# EasyEDA Pro project e_oct_dice_Dec_2022.eprj, board e_oct_dice_pcb_v0_3
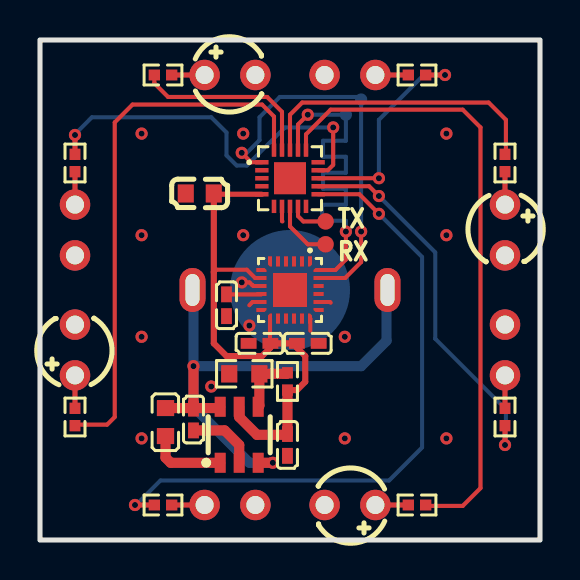
[diagram p9: board, top side]
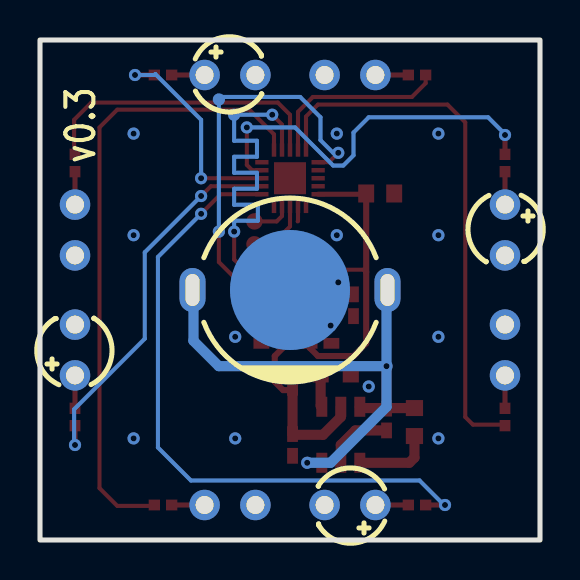
[diagram p10: board, bottom side, seen from below]

Outline 25 x 25 mm; copper layers: Top Layer, Bottom Layer. Coordinates in mm from the lower left corner of the outline.
Outline path: rectangle 0,25 25,0
Stack: Top Layer 0.035mm / Dielectric1 1.51mm FR4 er 4.5 / Bottom Layer 0.035mm

## Design rules (mm)
spacing safeClearance (default): track to track 0.152, other pairs 0.152 to 0.3
track width trackWidth (default): min 0.127, default 0.203, max 2.54
differential pair differentialPair (default): width min 0.127, default 0.254, max 2.54; gap min 0.152, default 0.152
via viaSize (default): diameter min 0.5, default 0.61, max 10; hole min 0.3, default 0.305, max 6

## Placement (name value [footprint] x y rotation side)
BT1  MY-927-01  [BAT-TH_MY-927-01]  12.5 12.5 180 bottom
C1  4.7uF  [C0402]  7.67 6.02 270 top
C2  4.7nF  [C0402]  12.37 4.75 90 top
C3  100nF  [C0402_NEW]  9.32 11.74 270 top
C4  10nF  [C0402]  13.39 9.83 0 top
C5  100nF  [C0402_NEW]  10.98 9.83 180 top
C6  22uF  [C0603]  7.99 17.33 0 top
L1  4.7uH  [L0603]  6.28 5.9 90 top
LED1  XL-302UWC  [LED-TH_BD3.8-P2.54-FD_WHITE]  15.5 1.75 180 top
LED2  XL-302UWC  [LED-TH_BD3.8-P2.54-FD_WHITE]  23.25 15.5 270 top
LED3  XL-302UWC  [LED-TH_BD3.8-P2.54-FD_WHITE]  9.5 23.25 0 top
LED4  XL-302UWC  [LED-TH_BD3.8-P2.54-FD_WHITE]  1.75 9.5 90 top
LED5  XL-302UWC  [LED-TH_BD3.8-P2.54-FD_WHITE]  9.5 1.75 0 bottom
LED6  XL-302UWC  [LED-TH_BD3.8-P2.54-FD_WHITE]  23.25 9.5 90 bottom
LED7  XL-302UWC  [LED-TH_BD3.8-P2.54-FD_WHITE]  15.5 23.25 180 bottom
LED8  XL-302UWC  [LED-TH_BD3.8-P2.54-FD_WHITE]  1.75 15.5 270 bottom
NOREF  -  [Pad_e1971]  14.28 14.79 0 top
NOREF#2  -  [Pad_e1246]  16.06 22.03 0 top
NOREF#3  -  [Pad_e1247]  15.29 21.26 0 top
NOREF#4  -  [Pad_e1972]  14.28 15.93 0 top
PR1  TPS61070DDCR  [SOT-23-6_L2.9-W1.6-P0.95-LS2.8-BR]  9.96 5.26 270 top
R1  1MΩ  [R0402]  12.37 7.93 270 top
R2  180kΩ  [R0603]  10.21 8.31 0 top
R3  470Ω  [R0402]  18.85 1.75 180 top
R4  470Ω  [R0402]  23.25 18.85 270 top
R5  470Ω  [R0402]  6.15 23.25 0 top
R6  470Ω  [R0402]  1.75 6.15 90 top
R7  470Ω  [R0402]  6.15 1.75 0 top
R8  470Ω  [R0402]  23.25 6.15 90 top
R9  470Ω  [R0402]  18.85 23.25 180 top
R10  470Ω  [R0402]  1.75 18.85 270 top
U1  STC8G1K17-38I-QFN20  [TQFN-20L_L3.0-W3.0-P0.40-BL-EP]  12.5 18.09 270 top
U2  MPU6500  [QFN-24_L3.0-W3.0-P0.40-BL-EP]  12.5 12.5 180 top

## Footprints (pads in the part's own frame, mm; a bottom-side part is the same pattern mirrored in y, then rotated)
BAT-TH_MY-927-01
  oval 1.3x2.2 hole 0.701x1.6: 1(-4.875,0) 1(4.875,0)
  round 6 smd: 2(0,0)
C0402
  rect 0.79x0.54 smd: 1(-0.545,0) 2(0.545,0)
C0402_NEW
  rect 0.79x0.54 smd: 1(-0.545,0) 2(0.545,0)
C0603
  rect 0.8x0.9 smd: 1(-0.7,0) 2(0.7,0)
L0603
  rect 0.8x0.864 smd: 1(-0.7,0) 2(0.7,0)
LED-TH_BD3.8-P2.54-FD_WHITE
  round 1.524 hole 0.9: 1(-1.27,0) 2(1.27,0)
Pad_e1246
  round 0.61 smd far side: TP4(0,0)
Pad_e1247
  round 0.61 smd far side: TP5(0,0)
Pad_e1971
  round 0.82 smd: TP1(0,0)
Pad_e1972
  round 0.82 smd: TP2(0,0)
QFN-24_L3.0-W3.0-P0.40-BL-EP
  custom 0.2x0.506 smd: 1(-1,-1.427) 6(1,-1.427) 13(1,1.427) 18(-1,1.427)
  rect 0.2x0.505 smd: 2(-0.6,-1.427) 3(-0.2,-1.427) 4(0.2,-1.427) 5(0.6,-1.427) 14(0.6,1.427) 15(0.2,1.427) 16(-0.2,1.427) 17(-0.6,1.427)
  custom 0.506x0.2 smd: 7(1.427,-1) 12(1.427,1) 19(-1.427,1) 24(-1.427,-1)
  rect 0.505x0.2 smd: 8(1.427,-0.6) 9(1.427,-0.2) 10(1.427,0.2) 11(1.427,0.6) 20(-1.427,0.6) 21(-1.427,0.2) 22(-1.427,-0.2) 23(-1.427,-0.6)
  rect 1.7x1.7 smd: 25(0,0)
R0402
  rect 0.566x0.54 smd: 1(-0.433,0) 2(0.433,0)
R0603
  rect 0.806x0.864 smd: 1(-0.753,0) 2(0.753,0)
SOT-23-6_L2.9-W1.6-P0.95-LS2.8-BR
  rect 1x0.55 smd: 1(1.4,-0.95) 2(1.4,0) 3(1.4,0.95) 4(-1.4,0.95) 5(-1.4,0) 6(-1.4,-0.95)
TQFN-20L_L3.0-W3.0-P0.40-BL-EP
  rect 0.224x0.665 smd: 1(-0.8,-1.407) 2(-0.4,-1.407) 3(0,-1.407) 4(0.4,-1.407) 5(0.8,-1.407) 11(0.8,1.407) 12(0.4,1.407) 13(0,1.407) 14(-0.4,1.407) 15(-0.8,1.407)
  rect 0.665x0.224 smd: 6(1.407,-0.8) 7(1.407,-0.4) 8(1.407,0) 9(1.407,0.4) 10(1.407,0.8) 16(-1.407,0.8) 17(-1.407,0.4) 18(-1.407,0) 19(-1.407,-0.4) 20(-1.407,-0.8)
  rect 1.6x1.6 smd: 21(0,0)

## Nets
As in the schematic, except:
MPU_SCL: NOREF#2.TP4 U1.1 U2.23
MPU_SDA: NOREF#3.TP5 U1.17 U2.24
RXD: NOREF.TP1 U1.8
TXD: NOREF#4.TP2 U1.9

Pads without a net: U1 2 3 4 6 10 15 21; U2 1 2 3 4 5 6 7 12 14 15 16 17 19 21 22 25

## Via types
v1: diameter 0.61, hole 0.305, Top Layer to Bottom Layer, 17 vias
v2: diameter 0.61, hole 0.304, Top Layer to Bottom Layer, 11 vias

## Routing (per net, layer and track width the routed paths; a pad name or vN(x,y) marks a point on that pad's centre or on a via; arc(x,y) is an arc through that point)
GND: length 7.2
  Top Layer w0.203: v1(10.09,12.88) 10.47,12.88 10.61,12.74 10.62,12.74 10.67,12.7 U2.9 ; 13.52,10.47 13.52,11.06 U2.18 ; 14.53,11.86 14.5,11.9 U2.20 ; U1.7 12.1,15.95 12.12,15.93 ; U2.11 10.63,11.9 10.47,11.74
  Top Layer w0.508: C1.2 9.24,5.48 9.96,4.75 PR1.2
  vias: v1(8.56,7.67) v1(10.47,10.72) v2(5.08,20.32) v2(5.08,15.24) v2(5.08,10.16) v2(5.08,5.08) v2(10.16,20.32) v2(10.16,15.24) v2(15.24,10.16) v2(15.24,5.08) v2(20.32,20.32) v2(20.32,15.24) v2(20.32,5.08)
VBAT: length 29.3
  Top Layer w0.508: PR1.6 8.94,6.6 7.67,6.6 ; L1.2 7.67,6.6 ; 7.67,6.6 v1(7.67,8.69) ; 7.67,6.6 C1.1 ; PR1.3 v1(11.64,3.86)
  Bottom Layer w0.508: BT1.1 7.67,12.45 v1(7.67,8.69) ; v1(11.64,3.86) 10.47,3.86 7.67,6.66 v1(7.67,8.69) ; v1(7.67,8.69) 16.06,8.69 17.33,9.96 17.33,12.45 BT1.1
VCC: length 27.2
  Top Layer w0.203: U2.8 10.76,13.1 10.34,13.52 8.82,13.52 8.69,13.39 ; C5.1 11.5,9.85 U2.13
  Top Layer w0.254: U1.5 8.73,17.29 C6.2
  Top Layer w0.305: C6.2 8.69,9.83 9.32,9.2 11.1,9.2 11.52,9.62 C5.1 C4.1 12.84,9.62 13.26,9.2 13.26,7.91 12.85,7.5 12.37,7.5
  Top Layer w0.508: 12.37,7.5 C2.2 12.34,5.26 10.85,5.26 9.96,6.15 PR1.5
LED_ANE: length 9.3
  Top Layer w0.203: R5.1 5.72,22.84 6.4,22.15 11.36,22.15 12.1,21.41 U1.19
LED_CYR: length 19.3
  Top Layer w0.203: U1.12 16.46,17.69 v1(16.94,17.2)
  Top Layer w0.254: v1(23.25,4.75) R8.1
  Bottom Layer w0.203: v1(23.25,4.75) 23.29,4.8 23.29,6.53 19.76,10.06 19.76,14.38 v1(16.94,17.2)
LED_DEN: length 32.5
  Top Layer w0.203: v1(16.94,16.31) 15.97,17.29 U1.11
  Top Layer w0.254: v1(4.75,1.75) R7.1
  Bottom Layer w0.203: v1(4.75,1.75) 4.8,1.75 6.02,2.97 17.45,2.97 19.1,4.63 19.1,14.15 v1(16.94,16.31)
LED_ELE: length 27.2
  Top Layer w0.203: R6.1 1.8,5.77 3.36,5.77 3.74,6.15 3.74,20.88 4.63,21.77 11.1,21.77 11.7,21.17 U1.20
LED_GEO: length 11.2
  Top Layer w0.203: U1.13 v1(16.94,18.09)
  Top Layer w0.254: v1(20.25,23.25) R9.1
  Bottom Layer w0.203: v1(20.25,23.25) 19.28,23.25 19.23,23.3 16.94,21.01 v1(16.94,18.09)
LED_HYD: length 14.9
  Top Layer w0.203: U1.18 12.5,21.26 13.11,21.87 22.43,21.87 23.29,21.01 23.29,19.33 R4.1
LED_PYR: length 31.6
  Top Layer w0.203: U1.16 13.3,20.28 14.53,21.52 21.14,21.52 22.03,20.63 22.03,2.59 21.14,1.7 19.33,1.7 R3.1
LED_WLD: length 19.5
  Top Layer w0.203: U1.14 14.39,18.49 14.66,18.75 v1(14.66,20.63)
  Top Layer w0.254: v1(1.75,20.25) R10.1
  Bottom Layer w0.203: v1(14.66,20.63) 12.25,20.63 10.34,18.72 9.83,18.72 9.32,19.23 9.32,20.37 8.56,21.14 2.59,21.14 1.75,20.29 v1(1.75,20.25)
MPU_SCL: length 19.6
  Top Layer w0.203: U1.1 10.56,18.89 v1(10.09,19.36) ; v1(16.06,15.42) 16.06,13.9 15.26,13.1 U2.23
  Bottom Layer w0.203: v1(16.06,15.42) NOREF#2.TP4 15.93,22.15 11.99,22.15 10.98,21.14 10.98,19.99 10.34,19.36 v1(10.09,19.36)
MPU_SDA: length 19.6
  Top Layer w0.203: v1(13.39,21.26) 12.9,20.77 U1.17 ; v1(15.29,15.42) 15.29,14.02 14.77,13.5 U2.24
  Bottom Layer w0.203: v1(13.39,21.26) NOREF#3.TP5 15.29,19.96 14.15,19.96 14.15,19.16 15.29,19.16 15.29,18.36 14.15,18.36 14.15,17.56 15.29,17.56 15.29,16.76 14.11,16.76 14.11,15.96 15.29,15.96 v1(15.29,15.42)
RXD: length 3.2
  Top Layer w0.203: U1.8 12.5,15.68 13.39,14.79 NOREF.TP1
TXD: length 1.8
  Top Layer w0.203: U1.9 12.9,16.2 13.17,15.93 14.15,15.93
$1N1768: length 3.9
  Top Layer w0.508: PR1.1 6.53,3.86 6.28,4.12 L1.1
$1N1911: length 3.1
  Top Layer w0.508: R1.1 12.32,8.31 R2.2 10.97,6.72 PR1.4
$1N2923: length 1.8
  Top Layer w0.203: C3.1 11.06,12.28 U2.10
$1N36634: length 1.6
  Top Layer w0.254: LED1.1 R3.2
$1N36786: length 1.6
  Top Layer w0.254: LED2.1 R4.2
$1N36892: length 1.6
  Top Layer w0.254: R5.2 LED3.1
$1N36980: length 1.6
  Top Layer w0.254: R6.2 LED4.1
$1N37068: length 1.6
  Top Layer w0.254: R7.2 LED5.1
$1N37156: length 1.6
  Top Layer w0.254: R8.2 LED6.1
$1N37244: length 1.6
  Top Layer w0.254: LED7.1 R9.2
$1N37332: length 1.6
  Top Layer w0.254: LED8.1 R10.2

## Copper pours and planes (outline as drawn; the poured copper is in the pictures)
GND on Top Layer: 0,25 25,25 25,0 0,0
GND on Bottom Layer: 0,25 25,25 25,0 0,0

## Text on the board
Bottom Silkscreen Layer: v0.3
Top Silkscreen Layer: TX | RX
